# Altium schematic sheet F1C100S-MY-电源.SchDoc
size A3; PageSetup: Record=PageOptions|CenterHorizontal=True|CenterVertical=True|PrintScale=0.73|XCorrection=1.00|YCorrection=1.00|PrintKind=0|BorderSize=5000000|LeftOffset=0|BottomOffset=0|Orientation=2|PaperLength=1000|PaperWidth=1000|Scale=100|PaperSource=7|PrintQuality=-3|MediaType=1|DitherType=10|PrintScaleMode=1|PaperKind=A4|PaperIndex=9
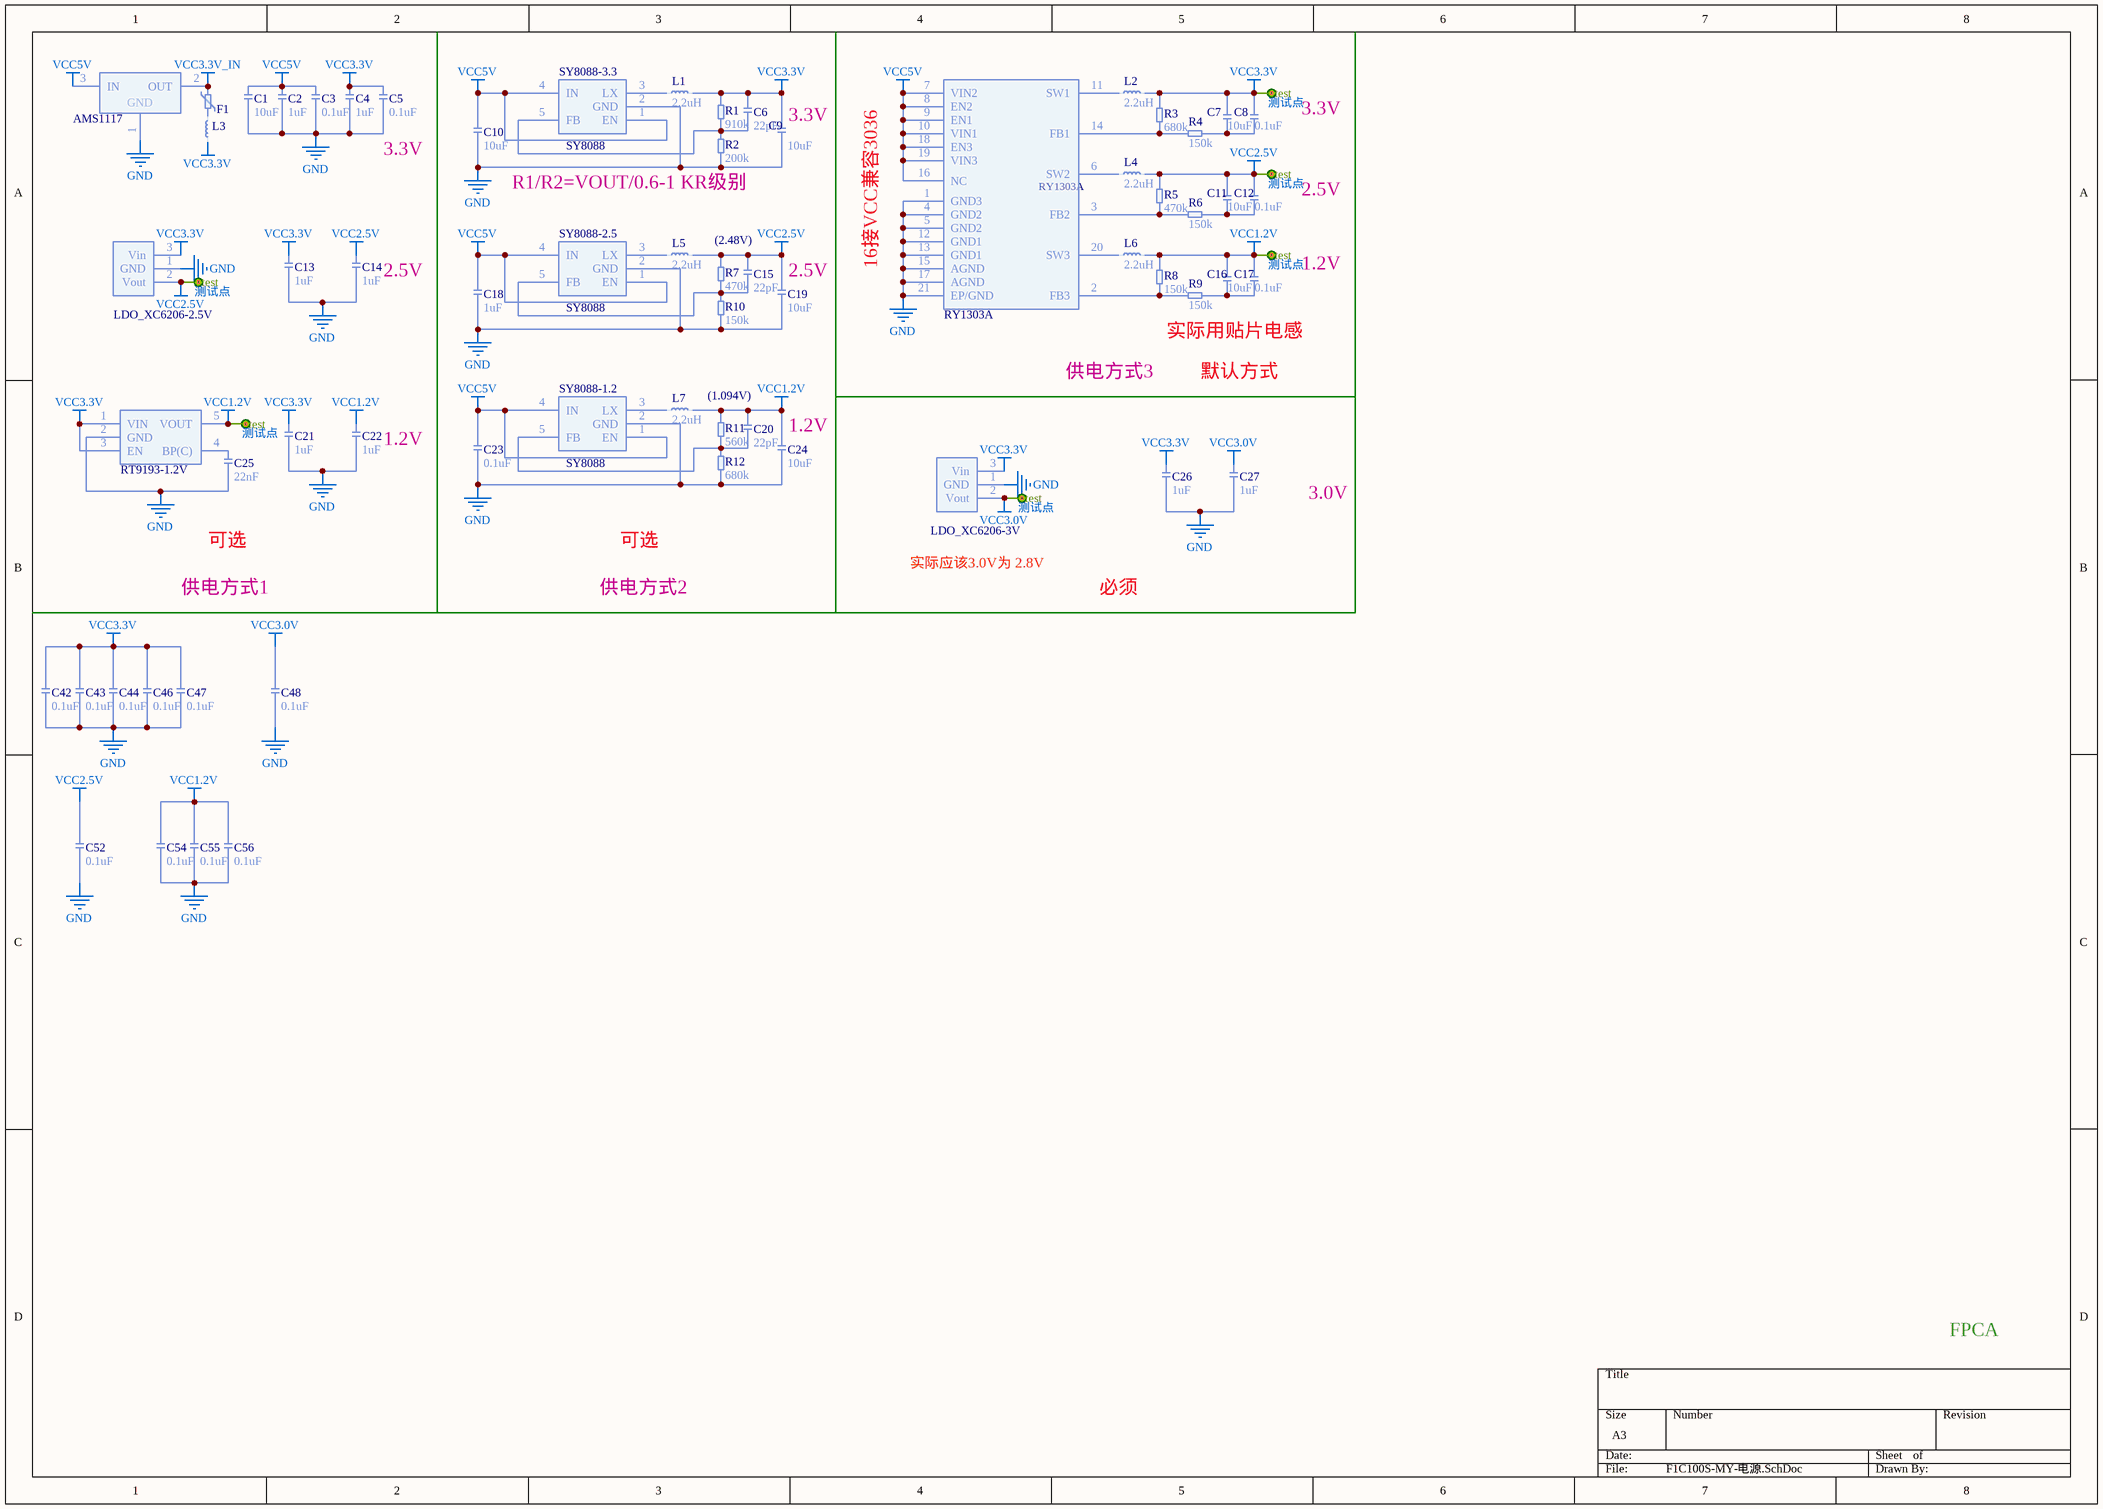
[diagram p0: F1C100S-MY-电源.SchDoc]

## Parts
AMS1117  LDO_AMS1117  [SOT-89]  (value not drawn)
C1  value 10uF  [0805C-mini]  (hidden comment: 非极性电容)
C2  value 1uF  [0603C-mini]  (hidden comment: 非极性电容)
C3  value 0.1uF  [0603C-mini]  (hidden comment: 非极性电容)
C4  value 1uF  [0603C-mini]  (hidden comment: 非极性电容)
C5  value 0.1uF  [0603C-mini]  (hidden comment: 非极性电容)
C6  value 22pF  [0603C-mini]  (hidden comment: 非极性电容)
C7  value 10uF  [0805C-mini]  (hidden comment: 非极性电容)
C8  value 0.1uF  [0603C-mini]  (hidden comment: 非极性电容)
C9  value 10uF  [0805C-mini]  (hidden comment: 非极性电容)
C10  value 10uF  [0805C-mini]  (hidden comment: 非极性电容)
C11  value 10uF  [0805C-mini]  (hidden comment: 非极性电容)
C12  value 0.1uF  [0603C-mini]  (hidden comment: 非极性电容)
C13  value 1uF  [0603C-mini]  (hidden comment: 非极性电容)
C14  value 1uF  [0603C-mini]  (hidden comment: 非极性电容)
C15  value 22pF  [0603C-mini]  (hidden comment: 非极性电容)
C16  value 10uF  [0805C-mini]  (hidden comment: 非极性电容)
C17  value 0.1uF  [0603C-mini]  (hidden comment: 非极性电容)
C18  value 1uF  [0805C-mini]  (hidden comment: 非极性电容)
C19  value 10uF  [0805C-mini]  (hidden comment: 非极性电容)
C20  value 22pF  [0603C-mini]  (hidden comment: 非极性电容)
C21  value 1uF  [0603C-mini]  (hidden comment: 非极性电容)
C22  value 1uF  [0603C-mini]  (hidden comment: 非极性电容)
C23  value 0.1uF  [0805C-mini]  (hidden comment: 非极性电容)
C24  value 10uF  [0805C-mini]  (hidden comment: 非极性电容)
C25  value 22nF  [0603C-mini]  (hidden comment: 非极性电容)
C26  value 1uF  [0603C-mini]  (hidden comment: 非极性电容)
C27  value 1uF  [0603C-mini]  (hidden comment: 非极性电容)
C42  value 0.1uF  [0603C-mini]  (hidden comment: 非极性电容)
C43  value 0.1uF  [0603C-mini]  (hidden comment: 非极性电容)
C44  value 0.1uF  [0603C-mini]  (hidden comment: 非极性电容)
C46  value 0.1uF  [0603C-mini]  (hidden comment: 非极性电容)
C47  value 0.1uF  [0603C-mini]  (hidden comment: 非极性电容)
C48  value 0.1uF  [0603C-mini]  (hidden comment: 非极性电容)
C52  value 0.1uF  [0603C-mini]  (hidden comment: 非极性电容)
C54  value 0.1uF  [0603C-mini]  (hidden comment: 非极性电容)
C55  value 0.1uF  [0603C-mini]  (hidden comment: 非极性电容)
C56  value 0.1uF  [0603C-mini]  (hidden comment: 非极性电容)
F1  自恢复保险丝  [FU 0603]  (value not drawn)
L1  value 2.2uH  [SMD-4.5x4.0x3.2mm]  (hidden comment: 贴片电感)
L2  value 2.2uH  [SMD-4.5x4.0x3.2mm]  (hidden comment: 贴片电感)
L3  磁珠  [0805C]  (value not drawn)
L4  value 2.2uH  [SMD-4.5x4.0x3.2mm]  (hidden comment: 贴片电感)
L5  value 2.2uH  [SMD-4.5x4.0x3.2mm]  (hidden comment: 贴片电感)
L6  value 2.2uH  [SMD-4.5x4.0x3.2mm]  (hidden comment: 贴片电感)
L7  value 2.2uH  [SMD-4.5x4.0x3.2mm]  (hidden comment: 贴片电感)
LDO_XC6206-2.5V  LDO_XC6206-SOT-23  [SOT-23]  (value not drawn)
LDO_XC6206-3V  LDO_XC6206-SOT-23  [SOT-23]  (value not drawn)
R1  value 910k  [R0603-mini]  (hidden comment: 贴片电阻)
R2  value 200k  [R0603-mini]  (hidden comment: 贴片电阻)
R3  value 680k  [R0603-mini]  (hidden comment: 贴片电阻)
R4  value 150k  [R0603-mini]  (hidden comment: 贴片电阻)
R5  value 470k  [R0603-mini]  (hidden comment: 贴片电阻)
R6  value 150k  [R0603-mini]  (hidden comment: 贴片电阻)
R7  value 470k  [R0603-mini]  (hidden comment: 贴片电阻)
R8  value 150k  [R0603-mini]  (hidden comment: 贴片电阻)
R9  value 150k  [R0603-mini]  (hidden comment: 贴片电阻)
R10  value 150k  [R0603-mini]  (hidden comment: 贴片电阻)
R11  value 560k  [R0603-mini]  (hidden comment: 贴片电阻)
R12  value 680k  [R0603-mini]  (hidden comment: 贴片电阻)
RT9193-1.2V  LDO_RT9193  [sot-23-5]  (value not drawn)
RY1303A  RY1303A-?  [QFN-20]  (value not drawn)
SY8088-1.2  SY8088  [SOT-23-5]
SY8088-2.5  SY8088  [SOT-23-5]
SY8088-3.3  SY8088  [SOT-23-5]
test1  测试点  [测试点30mil]
test2  测试点  [测试点30mil]
test3  测试点  [测试点30mil]
test4  测试点  [测试点30mil]
test5  测试点  [测试点30mil]
test6  测试点  [测试点30mil]

## Nets
GND: AMS1117.1(GND) C1.2 C2.2 C3.2 C4.2 C5.2 C9.2 C10.2 C13.1 C14.1 C18.2 C19.2 C21.2 C22.1 C23.2 C24.2 C25.2 C26.1 C27.1 C42.1 C43.1 C44.1 C46.1 C47.2 C48.1 C52.1 C54.1 C55.1 C56.1 LDO_XC6206-2.5V.1(GND) LDO_XC6206-3V.1(GND) R2.1 R10.1 R12.1 RT9193-1.2V.2(GND) RY1303A.1(GND3) RY1303A.4(GND2) RY1303A.5(GND2) RY1303A.12(GND1) RY1303A.13(GND1) RY1303A.15(AGND) RY1303A.17(AGND) RY1303A.21(EP/GND) SY8088-1.2.2(GND) SY8088-2.5.2(GND) SY8088-3.3.2(GND)
VCC1.2V: C16.1 C17.1 C20.1 C22.2 C24.1 C54.2 C55.2 C56.2 L6.2 L7.2 R8.2 R11.2 RT9193-1.2V.5(VOUT) test3.1(test) test5.1(test)
VCC2.5V: C11.1 C12.1 C14.2 C15.1 C19.1 C52.2 L4.2 L5.2 LDO_XC6206-2.5V.2(Vout) R5.2 R7.2 test2.1(test) test4.1(test)
VCC3.0V: C27.2 C48.2 LDO_XC6206-3V.2(Vout) test6.1(test)
VCC3.3V: C4.1 C5.1 C6.1 C7.1 C8.1 C9.1 C13.2 C21.1 C26.2 C42.2 C43.2 C44.2 C46.2 C47.1 L1.2 L2.2 L3.1 LDO_XC6206-2.5V.3(Vin) LDO_XC6206-3V.3(Vin) R1.2 R3.2 RT9193-1.2V.1(VIN) RT9193-1.2V.3(EN) test1.1(test)
VCC3.3V_IN: AMS1117.2(OUT) F1.2
VCC5V: AMS1117.3(IN) C1.1 C2.1 C3.1 C10.1 C18.1 C23.1 RY1303A.7(VIN2) RY1303A.8(EN2) RY1303A.9(EN1) RY1303A.10(VIN1) RY1303A.16(NC) RY1303A.18(EN3) RY1303A.19(VIN3) SY8088-1.2.1(EN) SY8088-1.2.4(IN) SY8088-2.5.1(EN) SY8088-2.5.4(IN) SY8088-3.3.1(EN) SY8088-3.3.4(IN)
NetC6_2: C6.2 R1.1 R2.2 SY8088-3.3.5(FB)
NetC7_2: C7.2 C8.2 R4.1
NetC11_2: C11.2 C12.2 R6.1
NetC15_2: C15.2 R7.1 R10.2 SY8088-2.5.5(FB)
NetC16_2: C16.2 C17.2 R9.1
NetC20_2: C20.2 R11.1 R12.2 SY8088-1.2.5(FB)
NetC25_1: C25.1 RT9193-1.2V.4(BP(C))
NetF1_1: F1.1 L3.2
NetL1_1: L1.1 SY8088-3.3.3(LX)
NetL2_1: L2.1 RY1303A.11(SW1)
NetL4_1: L4.1 RY1303A.6(SW2)
NetL5_1: L5.1 SY8088-2.5.3(LX)
NetL6_1: L6.1 RY1303A.20(SW3)
NetL7_1: L7.1 SY8088-1.2.3(LX)
NetR3_1: R3.1 R4.2 RY1303A.14(FB1)
NetR5_1: R5.1 R6.2 RY1303A.3(FB2)
NetR8_1: R8.1 R9.2 RY1303A.2(FB3)

## Notes on the sheet
- 3.3V
- (near C9) 3.3V
- (near R2) R1/R2=VOUT/0.6-1 KR级别
- (2.48V)
- 2.5V
- (near C14) 2.5V
- (near C19) 2.5V
- 16接VCC兼容3036
- 1.2V
- 供电方式3
- 实际用贴片电感
- 默认方式
- (near C22) 1.2V
- (1.094V)
- (near C24) 1.2V
- 3.0V
- 可选
- 实际应该3.0V为 2.8V
- 供电方式1
- 供电方式2
- 必须
- Labels drawn without touching a wire or pin: FPCA

## Library data of the parts
RT9193-1.2V = LDO_RT9193: 300ma 1.2V LDO
RY1303A = DCDC_RY1303A: 2A
SY8088-1.2 SY8088-2.5 SY8088-3.3 = DCDC_SY8088AAC
L3 = 磁珠: value: *